# EAGLE schematic hhv-dcdarknet (EAGLE 7.3.0)
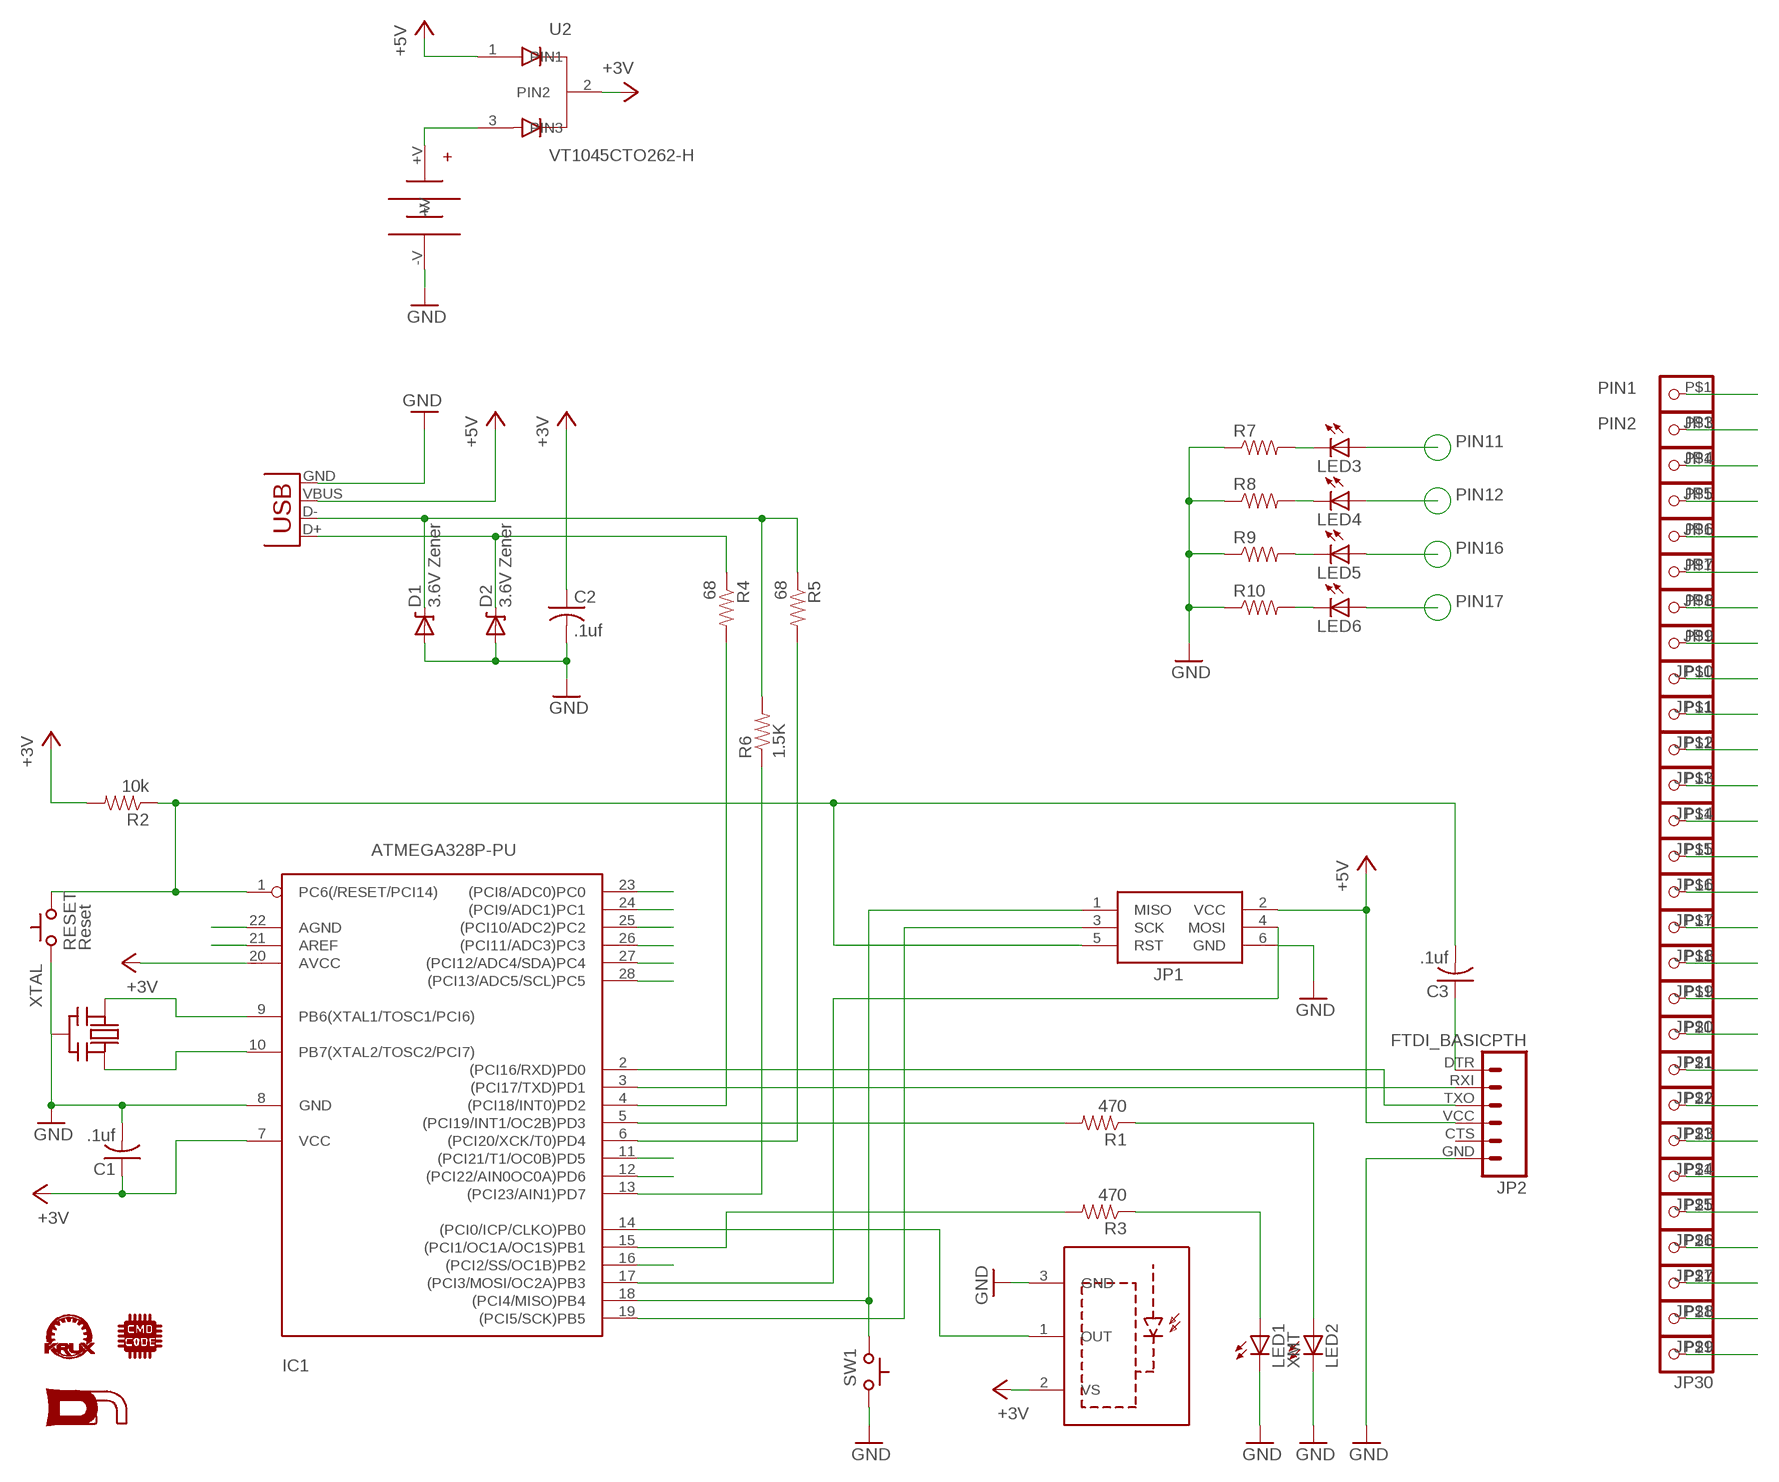
[diagram p0: schematic, sheet 1]

## Parts
C1  .1uf  C-US025-030X050  [C025-030X050]
C2  .1uf  C-US025-030X050  [C025-030X050]
C3  .1uf  C-US025-030X050  [C025-030X050]
D1  3.6V Zener  DIODE-ZENERPTH  [DIODE-ZENER]
D2  3.6V Zener  DIODE-ZENERPTH  [DIODE-ZENER]
IC1  ATMEGA328P-PU  ATMEGA168V-10P  [DIL28-3]
JP1  JP1  AVRISP-6  [AVRISP]
JP2  FTDI_BASICPTH  [FTDI_BASIC]
JP3  PINHD-1X11X1_SQUARE  [1X1-SMALL_CUT]
JP4  PINHD-1X11X1_SQUARE  [1X1-SMALL_CUT]
JP5  PINHD-1X11X1_SQUARE  [1X1-SMALL_CUT]
JP6  PINHD-1X11X1_SQUARE  [1X1-SMALL_CUT]
JP7  PINHD-1X11X1_SQUARE  [1X1-SMALL_CUT]
JP8  PINHD-1X11X1_SQUARE  [1X1-SMALL_CUT]
JP9  PINHD-1X11X1_SQUARE  [1X1-SMALL_CUT]
JP10  PINHD-1X11X1_SQUARE  [1X1-SMALL_CUT]
JP11  PINHD-1X11X1_SQUARE  [1X1-SMALL_CUT]
JP12  PINHD-1X11X1_SQUARE  [1X1-SMALL_CUT]
JP13  PINHD-1X11X1_SQUARE  [1X1-SMALL_CUT]
JP14  PINHD-1X11X1_SQUARE  [1X1-SMALL_CUT]
JP15  PINHD-1X11X1_SQUARE  [1X1-SMALL_CUT]
JP16  PINHD-1X11X1_SQUARE  [1X1-SMALL_CUT]
JP17  PINHD-1X11X1_SQUARE  [1X1-SMALL_CUT]
JP18  PINHD-1X11X1_SQUARE  [1X1-SMALL_CUT]
JP19  PINHD-1X11X1_SQUARE  [1X1-SMALL_CUT]
JP20  PINHD-1X11X1_SQUARE  [1X1-SMALL_CUT]
JP21  PINHD-1X11X1_SQUARE  [1X1-SMALL_CUT]
JP22  PINHD-1X11X1_SQUARE  [1X1-SMALL_CUT]
JP23  PINHD-1X11X1_SQUARE  [1X1-SMALL_CUT]
JP24  PINHD-1X11X1-SMALL  [1X1-SMALL]
JP25  PINHD-1X11X1-SMALL  [1X1-SMALL]
JP26  PINHD-1X11X1_SQUARE  [1X1-SMALL_CUT]
JP27  PINHD-1X11X1-SMALL  [1X1-SMALL]
JP28  PINHD-1X11X1_SQUARE  [1X1-SMALL_CUT]
JP29  PINHD-1X11X1-SMALL  [1X1-SMALL]
JP30  PINHD-1X11X1-SMALL  [1X1-SMALL]
LED1  XMT  LED5MM-FLAT  [LED5MM-FLAT]
LED2  LED5MM-FLAT  [LED5MM-FLAT]
LED3  LED1206  [LED-1206]
LED4  LED1206  [LED-1206]
LED5  LED1206  [LED-1206]
LED6  LED1206  [LED-1206]
R1  470  RESISTORAXIAL-0.3  [AXIAL-0.3]
R2  10k  RESISTORAXIAL-0.3  [AXIAL-0.3]
R3  470  RESISTORAXIAL-0.3  [AXIAL-0.3]
R4  68  RESISTORAXIAL-0.3  [AXIAL-0.3]
R5  68  RESISTORAXIAL-0.3  [AXIAL-0.3]
R6  1.5K  RESISTORAXIAL-0.3  [AXIAL-0.3]
R7  RESISTOR1206  [1206]
R8  RESISTOR1206  [1206]
R9  RESISTOR1206  [1206]
R10  RESISTOR1206  [1206]
RESET  Reset  SWITCH_TACTILETACTILE-2PIN  [TACTILE-2PIN]
SW1  SWITCH_TACTILETACTILE-2PIN  [TACTILE-2PIN]
U1  RCV  SOP22  [IR-MODULE]
U2  VT1045CTO262-H  [TO262-H]
U$1  DN_LOGO  [DN_LOGO]
U$2  CMDC0DE_LOGO  [CMDC0DE]
U$3  KRUX_LOGO  [KRUX_LOGO]
U$5  12BH423-GR3-CELL_NOBORDER  [3-AAA-CELL_NOBORDER]
X2  USB  USBPTH  [USB-B-PTH]
XTAL  CERMOSCILL-THM  [CERM_OSC]

## Nets
+3V3: C1.1 C2.1 IC1.7(VCC) IC1.20(AVCC) JP9.P$1 JP22.P$1 R2.P$2 U1.2(VS) U2.2(PIN2) ; supply symbol labelled +3V
+5V: JP1.2(VCC) JP2.VCC U2.1(PIN1) X2.VBUS
GND: C1.2 C2.2 D1.P$2(A) D2.P$2(A) IC1.8(GND) JP1.6(GND) JP2.GND JP10.P$1 LED1.K(C) LED2.K(C) R7.1 R8.1 R9.1 R10.1 RESET.P$2(C) SW1.P$1(A) U1.3(GND) U$5.-V X2.GND XTAL.P$2(GND)
N$1: C3.1 JP2.DTR
N$2: LED3.C R7.2
N$3: LED4.C R8.2
N$4: LED5.C R9.2
N$5: LED6.C R10.2
N$7: LED1.A R3.P$1
N$8: LED2.A R1.P$1
N$13: D2.P$1(C) R4.P$1 X2.D+
N$15: U2.3(PIN3) U$5.+V
PIN1: C3.2 IC1.1(PC6(/RESET/PCI14)) JP1.5(RST) JP3.P$1 R2.P$1 RESET.P$1(A)
PIN2: IC1.2((PCI16/RXD)PD0) JP2.TXO JP4.P$1
PIN3: IC1.3((PCI17/TXD)PD1) JP2.RXI JP5.P$1
PIN4: IC1.4((PCI18/INT0)PD2) JP6.P$1 R4.P$2
PIN5: IC1.5((PCI19/INT1/OC2B)PD3) JP7.P$1 R1.P$2
PIN6: IC1.6((PCI20/XCK/T0)PD4) JP8.P$1 R5.P$2
PIN9: IC1.9(PB6(XTAL1/TOSC1/PCI6)) JP11.P$1 XTAL.P$1(IN)
PIN10: IC1.10(PB7(XTAL2/TOSC2/PCI7)) JP12.P$1 XTAL.P$3(OUT)
PIN11: IC1.11((PCI21/T1/OC0B)PD5) JP13.P$1 LED3.A
PIN12: IC1.12((PCI22/AIN0OC0A)PD6) JP14.P$1 LED4.A
PIN13: IC1.13((PCI23/AIN1)PD7) JP15.P$1 R6.P$1
PIN14: IC1.14((PCI0/ICP/CLKO)PB0) JP16.P$1 U1.1(OUT)
PIN15: IC1.15((PCI1/OC1A/OC1S)PB1) JP17.P$1 R3.P$2
PIN16: IC1.16((PCI2/SS/OC1B)PB2) JP18.P$1 LED5.A
PIN17: IC1.17((PCI3/MOSI/OC2A)PB3) JP1.4(MOSI) JP19.P$1 LED6.A
PIN18: IC1.18((PCI4/MISO)PB4) JP1.1(MISO) JP20.P$1 SW1.P$2(C)
PIN19: IC1.19((PCI5/SCK)PB5) JP1.3(SCK) JP21.P$1
PIN21: IC1.21(AREF) JP23.P$1
PIN22: IC1.22(AGND) JP24.P$1
PIN23: IC1.23((PCI8/ADC0)PC0) JP25.P$1
PIN24: IC1.24((PCI9/ADC1)PC1) JP26.P$1
PIN25: IC1.25((PCI10/ADC2)PC2) JP27.P$1
PIN26: IC1.26((PCI11/ADC3)PC3) JP28.P$1
PIN27: IC1.27((PCI12/ADC4/SDA)PC4) JP29.P$1
PIN28: IC1.28((PCI13/ADC5/SCL)PC5) JP30.P$1
USB: D1.P$1(C) R5.P$1 R6.P$2 X2.D-
Unconnected: JP2.CTS

## Notes on the sheet
- PIN11
- PIN12
- PIN16
- PIN17

## Library data of the parts
C1-C3 = adafruit:C-US: CAPACITOR, American symbol
D1 D2 = SparkFun:DIODE-ZENER: Zener Diode Production Part - 8199 3.4V Zener Voltage
IC1 = adafruit:ATMEGA168*P: MICROCONTROLLER 16 kBytes FLASH 1 kBytes SRAM 512 Bytes EEPROM USART 8-channel 10 bit ADC
JP1 = SYNShop:AVRISP: AVR ISP HEADER Standard 6 pin header for AVR programming
JP2 = SparkFun:FTDI_BASIC: FTDI Basic: 3.3V and 5V
JP3-JP30 = adafruit:PINHD-1X1: Pin header 1x1 for 0.1" spacing With round pins
LED1 LED2 = SYNShop:LED: LEDs Standard schematic elements and footprints for 5mm, 3mm, 1206, and 0603 sized LEDs. 5mm - Spark Fun Electronics SKU : COM-00529 (and others)
LED3-LED6 = SparkFun:LED: LEDs Standard schematic elements and footprints for 5mm, 3mm, 1206, and 0603 sized LEDs. 5mm - Spark Fun Electronics SKU : COM-00529 (and others)
R1-R6 = SYNShop:RESISTOR: Resistor Basic schematic elements and footprints for 0603, 1206, and PTH resistors.
R7-R10 = SparkFun:RESISTOR: Resistor Basic schematic elements and footprints for 0603, 1206, and PTH resistors.
RESET SW1 = SYNShop:SWITCH_TACTILE
U1 = SYNShop:SOP22
U2 = SYNShop:VT1045C
U$1 = SYNShop:DN_LOGO
U$2 = SYNShop:CMDC0DE_LOGO
U$3 = SYNShop:KRUX_LOGO
U$5 = SYNShop:12BH423-GR
X2 = SparkFun:USB: USB Connectors USB-B-PTH is fully proven SKU : PRT-00139 USB-miniB is fully proven SKU : PRT-00587 USB-A-PCB is untested. USB-A-H is throughly reviewed, but untested. Spark Fun Electronics SKU : PRT-00437 USB-B-SMT is throughly reviewed, but untested. Needs silkscreen touching up. USB-A-S has not been used/tested USB-MB-H has not been used/tested
XTAL = adafruit:CERMOSCILL: Ceramic oscillator with built in capacitors such as ZTT-12MHz http://www.ladyada.net/library/eagle

## Net classes
0 default: clearance 0.205 mm